# EAGLE design Aquarius (EAGLE 6.4)
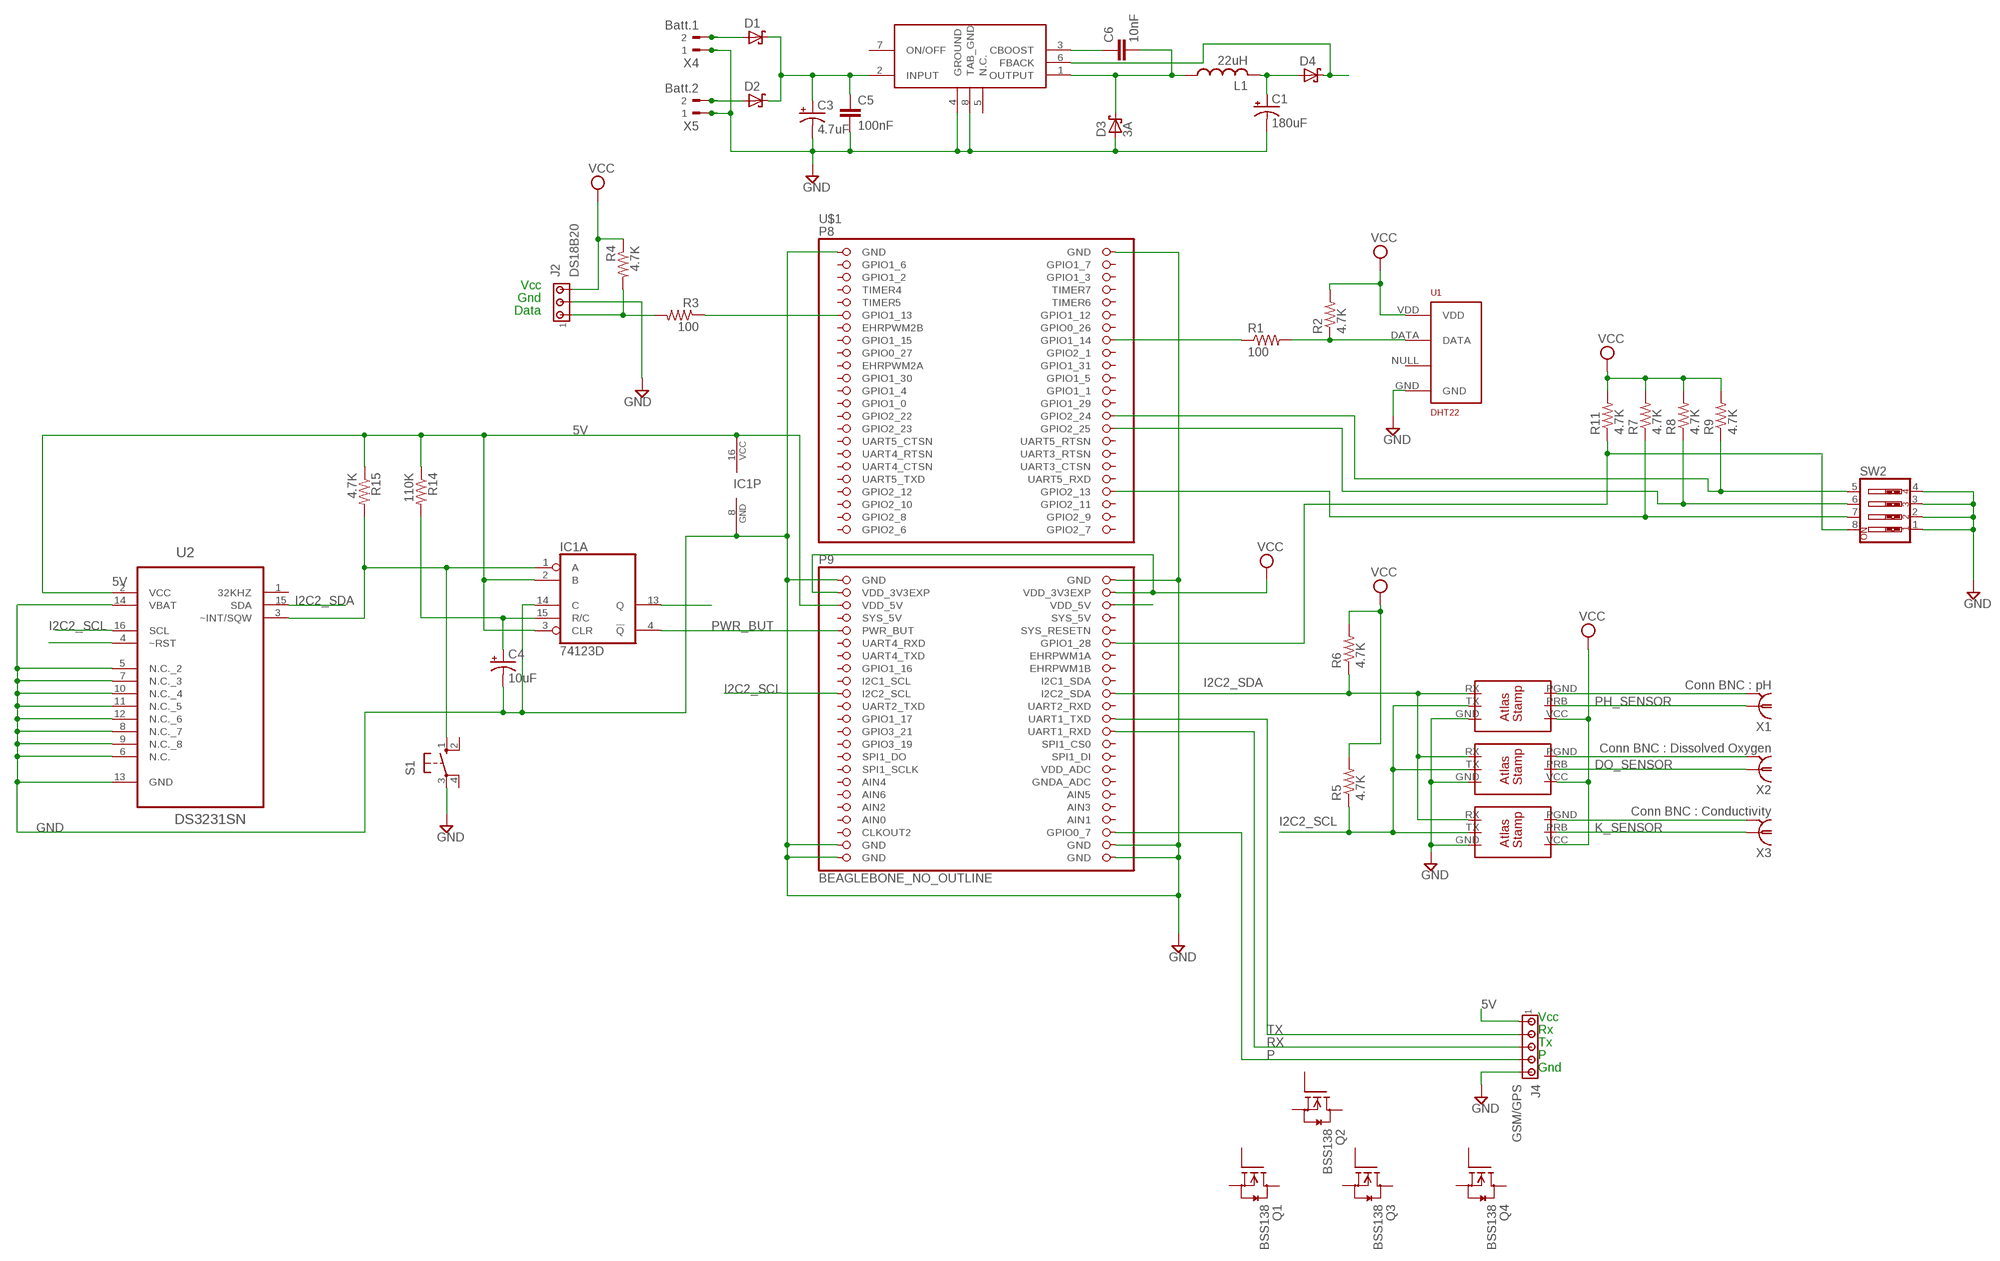
[diagram p0: schematic, sheet 1]

## Parts
C1  180uF  CPOL-USE2,5-6E  [E2,5-6E]
C3  4.7uF  CPOL-USE2,5-6E  [E2,5-6E]
C4  10uF  CPOL-USE2,5-6E  [E2,5-6E]
C5  100nF  C-EUC0805  [C0805@1]
C6  10nF  C-EUC0805  [C0805@1]
D1  SCHOTTKY-DIODEDO201T15  [DO201T15]
D2  SCHOTTKY-DIODEDO201T15  [DO201T15]
D3  3A  SCHOTTKY-DIODEDO201T15  [DO201T15]
D4  SCHOTTKY-DIODEDO201T15  [DO201T15]
IC1  74123D  [SO16]
J2  DS18B20  MTA03-100  [10X03MTA]
J4  GSM/GPS  MTA05-100  [10X05MTA]
L1  22uH  L-USLAL04  [LAL04]
LM2678  LM2678KTW0007B  [TO-PMOD7]
Q1  BSS138  [SOT23]
Q2  BSS138  [SOT23]
Q3  BSS138  [SOT23]
Q4  BSS138  [SOT23]
R1  100  R-US_R0805  [R0805]
R2  4.7K  R-US_R0805  [R0805]
R3  100  R-US_R0805  [R0805]
R4  4.7K  R-US_R0805  [R0805]
R5  4.7K  R-US_R0805  [R0805]
R6  4.7K  R-US_R0805  [R0805]
R7  4.7K  R-US_R0805  [R0805]
R8  4.7K  R-US_R0805  [R0805]
R9  4.7K  R-US_R0805  [R0805]
R11  4.7K  R-US_R0805  [R0805]
R14  110K  R-US_R0805  [R0805]
R15  4.7K  R-US_R0805  [R0805]
S1  10-XX  [B3F-10XX]
SW2  SW_DIP-4  [EDG-04]
U1  DHT22  RHT03_DHT-22_AM2302WIRED  [AM2302]
U2  DS3231SN  [SOIC127P1032X265-16N]
U$1  BEAGLEBONE_NO_OUTLINE  [BEAGLEBONE_SHIELD_NO_OUTLINE]
U$2  ATLAS_STAMP  [ATLAS_STAMP]
U$3  ATLAS_STAMP  [ATLAS_STAMP]
U$4  ATLAS_STAMP  [ATLAS_STAMP]
X1  Conn BNC : pH  1-227161-0  [AMP_227161]
X2  Conn BNC : Dissolved Oxygen  1-227161-0  [AMP_227161]
X3  Conn BNC : Conductivity  1-227161-0  [AMP_227161]
X4  Batt.1  180G-2  [180G-2]
X5  Batt.2  180G-2  [180G-2]

## Nets
5V: D4.C IC1.2(A:B) IC1.3(A:CLR) IC1.16(P:VCC) J4.1 LM2678.6(FBACK) R14.1 R15.1 U2.2(VCC) U$1.51(VDD_5V) U$1.52(VDD_5V)
DO_SENSOR: U$3.PRB X2.1
GND: C1.- C3.- C4.- C5.2 D3.A IC1.8(P:GND) IC1.14(A:C) J2.2 J4.5 LM2678.4(GROUND) LM2678.8(TAB_GND) S1.3(P) SW2.1 SW2.2 SW2.3 SW2.4 U1.GND U2.5(N.C._2) U2.6(N.C.) U2.7(N.C._3) U2.8(N.C._7) U2.9(N.C._8) U2.10(N.C._4) U2.11(N.C._5) U2.12(N.C._6) U2.13(GND) U2.14(VBAT) U$1.1(GND) U$1.2(GND) U$1.47(GND) U$1.48(GND) U$1.89(GND) U$1.90(GND) U$1.91(GND) U$1.92(GND) U$2.GND U$3.GND U$4.GND X4.1 X5.1
I2C2_SCL: R5.1 U2.16(SCL) U$1.65(I2C2_SCL) U$2.TX U$3.TX U$4.TX
I2C2_SDA: R6.1 U2.15(SDA) U$1.66(I2C2_SDA) U$2.RX U$3.RX U$4.RX
INT: IC1.1(A:A) R15.2 S1.1(S) U2.3(~INT/SQW)
K_SENSOR: U$4.PRB X3.1
N$2: D1.A X4.2
N$3: R1.2 R2.1 U1.DATA
N$4: R3.1 U$1.11(GPIO1_13)
N$5: J2.1 R3.2 R4.2
N$6: R1.1 U$1.16(GPIO1_14)
N$7: R7.1 SW2.7 U$1.40(GPIO2_13)
N$8: D2.A X5.2
N$9: C6.1 LM2678.3(CBOOST)
N$10: C3.+ C5.1 D1.C D2.C LM2678.2(INPUT)
N$11: U$2.PGND X1.2
N$12: U2.4(~RST)
N$13: C6.2 D3.C L1.1 LM2678.1(OUTPUT)
N$14: U$4.PGND X3.2
N$15: U$3.PGND X2.2
N$16: C1.+ D4.A L1.2
N$17: C4.+ IC1.15(A:R/C) R14.2
N$18: R11.1 SW2.8 U$1.58(GPIO1_28)
N$19: R8.1 SW2.6 U$1.30(GPIO2_25)
N$20: IC1.13(A:Q)
N$21: R9.1 SW2.5 U$1.28(GPIO2_24)
P: J4.4 U$1.88(GPIO0_7)
PH_SENSOR: U$2.PRB X1.1
PWR_BUT: IC1.4(A:!Q) U$1.55(PWR_BUT)
RX: J4.3 U$1.72(UART1_RXD)
TX: J4.2 U$1.70(UART1_TXD)
VCC: J2.3 R2.2 R4.1 R5.2 R6.2 R7.2 R8.2 R9.2 R11.2 U1.VDD U$1.49(VDD_3V3EXP) U$1.50(VDD_3V3EXP) U$2.VCC U$3.VCC U$4.VCC
Unconnected: IC1.5(B:Q) IC1.6(B:C) IC1.7(B:R/C) IC1.9(B:A) IC1.10(B:B) IC1.11(B:CLR) IC1.12(B:!Q) LM2678.5(N.C.) LM2678.7(ON/OFF) Q1.1(G) Q1.2(S) Q1.3(D) Q2.1(G) Q2.2(S) Q2.3(D) Q3.1(G) Q3.2(S) Q3.3(D) Q4.1(G) Q4.2(S) Q4.3(D) S1.2(S1) S1.4(P1) U1.NULL U2.1(32KHZ) U$1.3(GPIO1_6) U$1.4(GPIO1_7) U$1.5(GPIO1_2) U$1.6(GPIO1_3) U$1.7(TIMER4) U$1.8(TIMER7) U$1.9(TIMER5) U$1.10(TIMER6) U$1.12(GPIO1_12) U$1.13(EHRPWM2B) U$1.14(GPIO0_26) U$1.15(GPIO1_15) U$1.17(GPIO0_27) U$1.18(GPIO2_1) U$1.19(EHRPWM2A) U$1.20(GPIO1_31) U$1.21(GPIO1_30) U$1.22(GPIO1_5) U$1.23(GPIO1_4) U$1.24(GPIO1_1) U$1.25(GPIO1_0) U$1.26(GPIO1_29) U$1.27(GPIO2_22) U$1.29(GPIO2_23) U$1.31(UART5_CTSN) U$1.32(UART5_RTSN) U$1.33(UART4_RTSN) U$1.34(UART3_RTSN) U$1.35(UART4_CTSN) U$1.36(UART3_CTSN) U$1.37(UART5_TXD) U$1.38(UART5_RXD) U$1.39(GPIO2_12) U$1.41(GPIO2_10) U$1.42(GPIO2_11) U$1.43(GPIO2_8) U$1.44(GPIO2_9) U$1.45(GPIO2_6) U$1.46(GPIO2_7) U$1.54(SYS_5V) U$1.56(SYS_RESETN) U$1.57(UART4_RXD) U$1.59(UART4_TXD) U$1.60(EHRPWM1A) U$1.61(GPIO1_16) U$1.62(EHRPWM1B) U$1.63(I2C1_SCL) U$1.64(I2C1_SDA) U$1.67(UART2_TXD) U$1.68(UART2_RXD) U$1.69(GPIO1_17) U$1.71(GPIO3_21) U$1.73(GPIO3_19) U$1.74(SPI1_CS0) U$1.75(SPI1_DO) U$1.76(SPI1_DI) U$1.77(SPI1_SCLK) U$1.78(VDD_ADC) U$1.79(AIN4) U$1.80(GNDA_ADC) U$1.81(AIN6) U$1.82(AIN5) U$1.83(AIN2) U$1.84(AIN3) U$1.86(AIN1) U$1.87(CLKOUT2)

## Notes on the sheet
- Vcc
- Gnd
- Data
- Vcc
- Rx
- Tx
- P
- Gnd

## Power pins joined to a net without a drawn wire
AIN0: U$1.85(AIN0)
SYS_5V: U$1.53(SYS_5V)

## Library data of the parts
C1 C3 C4 = resistor:CPOL-US: POLARIZED CAPACITOR, American symbol
C5 C6 = rcl:C-EU: CAPACITOR, European symbol
D1-D4 = diode:SCHOTTKY-DIODE: Schottky Diode
IC1 = 74xx-us:74*123: Retriggerable monostable MULTIVIBRATOR
J2 = con-amp:MTA03-100: AMP connector
J4 = con-amp:MTA05-100: AMP connector
L1 = rcl:L-US: INDUCTOR, American symbol
LM2678 = Aquarius:LM2678: LM2678 SIMPLE SWITCHER® High Efficiency 5A Step-Down Voltage Regulator
Q1-Q4 = m-pad-2.1:BSS138: Fairchild Semiconductors BSS138 N-Channel Logic Level Enhancement Mode Field Effect Transistor General Description: These N-Channel enhancement mode field effect transistors are produced using Fairchild's proprietary, high cell density, DMOS technology. These products have been designed to minimize on-state resistance while provide rugged, reliable, and fast switching performance.These products are particularly suited for low voltage, low current applications such as small servo motor control, power MOSFET gate drivers, and other switching applications. Features: 0.22 A, 50 V. RDS(ON) = 3.5Ohm @ VGS = 10 V RDS(ON) = 6.0Ohm @ VGS = 4.5 V High density cell design for extremely low RDS(ON) Rugged and Reliable Compact industry standard SOT-23 surface mount package Please send any comments to: messi@users.sourceforge.net
R1-R9 R11 R14 R15 = adafruit:R-US_: RESISTOR, American symbol
S1 = switch-omron:10-XX: OMRON SWITCH; MPN: B3F-1000; OC_FARNELL: 176432; OC_NEWARK: 36M3542
SW2 = special:SW_DIP-4: DIP SWITCH
U1 = RHT03_DHT-22_AM2302:RHT03_DHT-22_AM2302: RHT03 / DHT-22 / AM2302 Packages and symbol for the RHT03 / DHT-22 relative humidity and temperature sensor. Note: The AM2302 is a wired version of the DHT-22 which typically requires less clearance and is thus provided as a separate package.; PROD_ID: SEN-10167
U2 = Maxim_By_element14_Batch_1:DS3231SN: Extremely Accurate I2C-Integrated RTC/TCXO/Crystal; MPN: DS3231SN#; OC_FARNELL: 1593292; OC_NEWARK: 68K3406; PACKAGE: SOIC-16; SUPPLIER: Maxim
U$1 = LEDscape:BEAGLEBONE_NO_OUTLINE: Should match A3 pinout - but not completely tested
U$2-U$4 = LEDscape:ATLAS_STAMP
X1-X3 = con-coax:?227161*: JACK, RIGHT ANGLE, 50 OHM, PCB, BNC Source: amp_227161.pdf; MF: TYCO ELECTRONICS; MPN: 1-227161; OC_FARNELL: unknown; OC_NEWARK: 33B3200
X4 X5 = con-weidmueller-sl35:180G-2: WEIDMUELLER CLAMP CONNECTOR

## Board
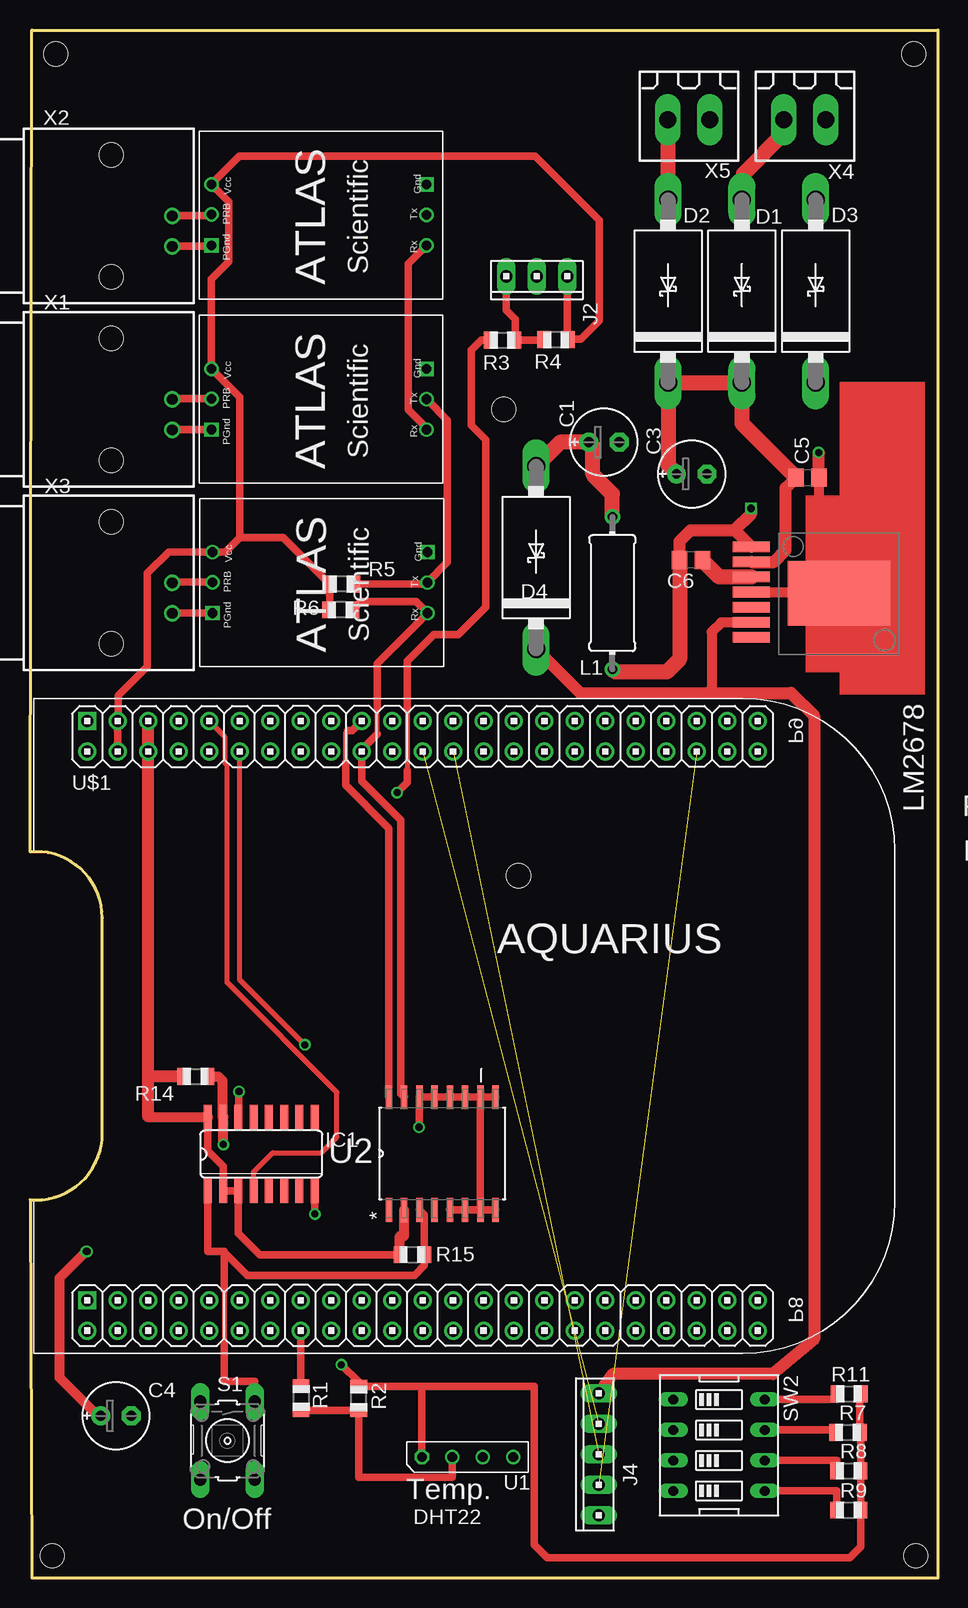
[diagram p1: board, top side]
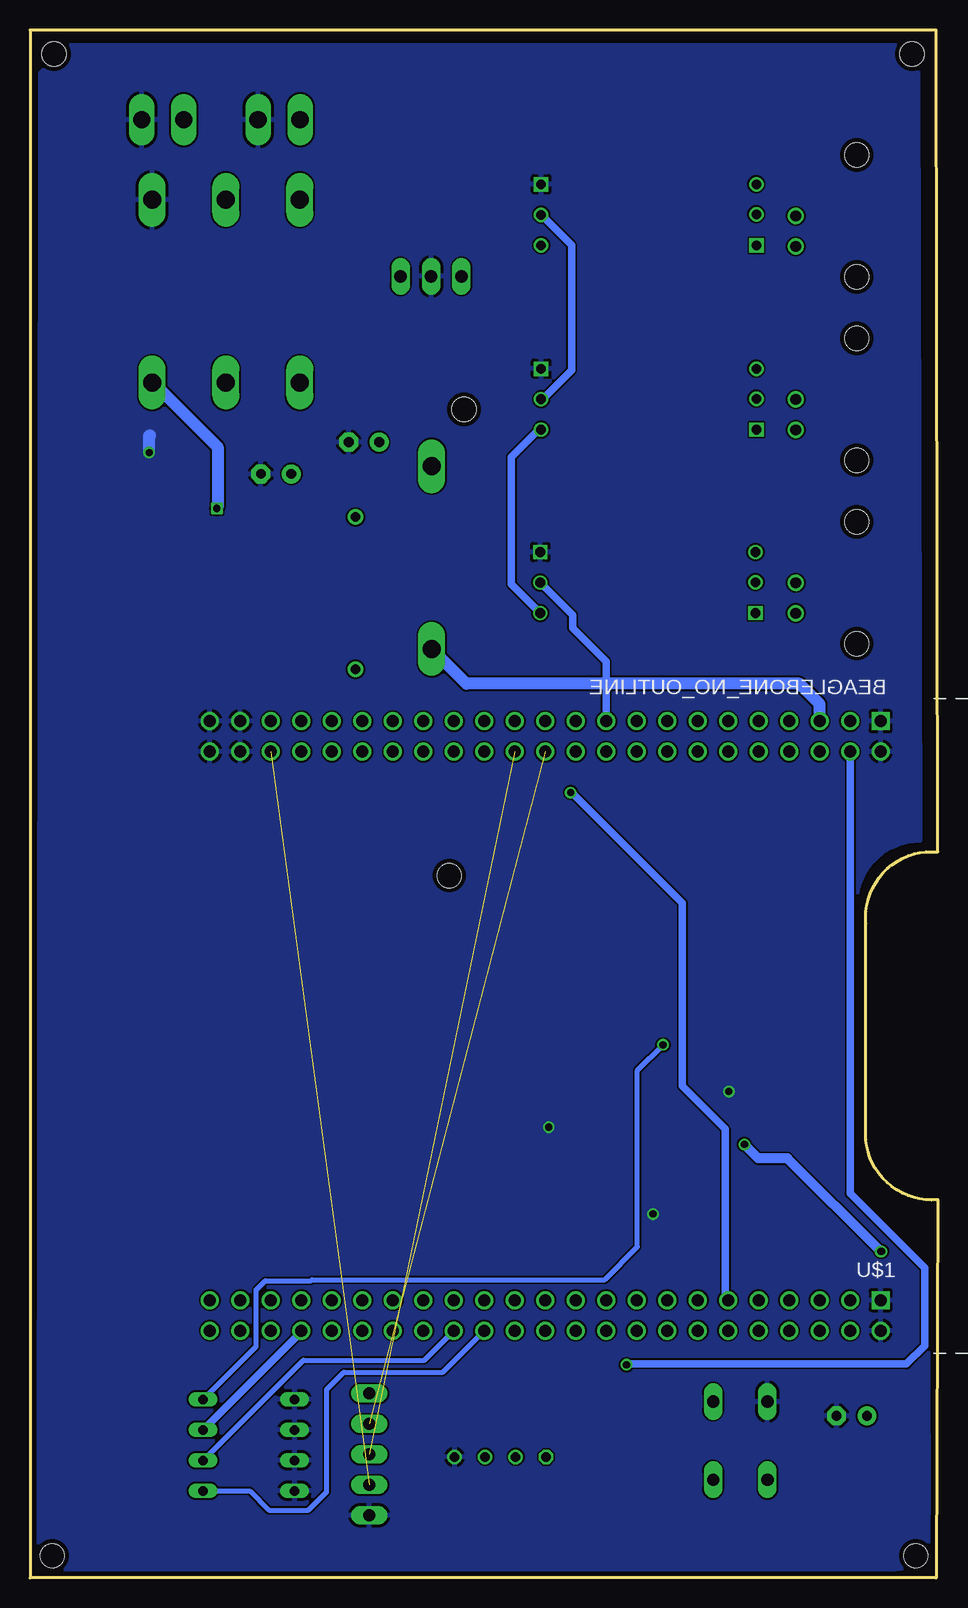
[diagram p2: board, bottom side, seen from below]

Size 75.65 x 129.03 mm. Coordinates in mm from the lower left corner, seen from the top.
Outline: 0.15,129.03 75.65,129.03 75.65,0 0.15,0 0,31.53 arc90 6,36.53 6,54.53 arc90 1,60.53 0,60.53 0.15,129.03
Copper layers (1*16): Top 0.0356mm / dielectric 1.5011mm / Bottom 0.0356mm
Design rules "LaenPCBOrder": minimum track width 6mil, minimum drill 13mil, track to track 6mil, track to pad 6mil, pad to pad 6mil, via to via 6mil, smd to smd 6mil, copper to edge 15mil, drill to drill 6mil, minimum pad ring 7mil, minimum via ring 7mil, stop-mask expansion 3mil, vias tented up to drill 0mil, thermal gap 10mil
Holes 2 mm at 1.85,1.85 73.8,1.85 73.65,127.03 2.15,127.03 40.71,58.54 39.49,97.4

### Footprints (pad centres in the part's own frame; a part is rotated, then mirrored left to right if it is on the bottom)
E2,5-6E = drill 0.813 pad 1.575: + -1.27,0 | drill 0.813 pad 1.575 octagon: - 1.27,0
C0805 = smd 1.3 x 1.5: 1 -0.95,0; 2 0.95,0
DO201T15 = drill 1.499 long: A 7.62,0; C -7.62,0
SO16 = smd 0.66 x 2.032: 1 -4.445,-3.073; 2 -3.175,-3.073; 3 -1.905,-3.073; 4 -0.635,-3.073; 5 0.635,-3.073; 6 1.905,-3.073; 7 3.175,-3.073; 8 4.445,-3.073; 9 4.445,3.073; 10 3.175,3.073; 11 1.905,3.073; 12 0.635,3.073; 13 -0.635,3.073; 14 -1.905,3.073; 15 -3.175,3.073; 16 -4.445,3.073
10X03MTA = drill 1.016 long: 1 2.54,0; 2 0,0; 3 -2.54,0
10X05MTA = drill 1.016 long: 1 5.08,0; 2 2.54,0; 3 0,0; 4 -2.54,0; 5 -5.08,0
LAL04 = drill 0.8 pad 1.3: 1 -6.35,0; 2 6.35,0
TO-PMOD7 = smd 0.89 x 3.06: 1 -3.88,-7.3; 2 -2.62,-7.3; 3 -1.36,-7.3; 4 -0.1,-7.3; 5 1.16,-7.3; 6 2.42,-7.3; 7 3.68,-7.3 | smd 5.35 x 8.54: 8 0.01,0
SOT23 = smd 0.9 x 1.2: 1 -0.95,-1.2; 2 0.95,-1.2; 3 0,1.2
R0805 = smd 1.1 x 1.4: 1 -1,0; 2 1,0
B3F-10XX = drill 1.016 long: 1 -3.251,2.261; 2 3.251,2.261; 3 -3.251,-2.261; 4 3.251,-2.261
EDG-04 = drill 0.813 long: 1 -3.81,-3.81; 2 -1.27,-3.81; 3 1.27,-3.81; 4 3.81,-3.81; 5 3.81,3.81; 6 1.27,3.81; 7 -1.27,3.81; 8 -3.81,3.81
AM2302 = drill 0.8: DATA -1.27,0; GND 3.81,0; NULL 1.27,0 | drill 0.8 octagon: VDD -3.81,0
SOIC127P1032X265-16N = smd 1.981 x 0.533: 1 -4.699,4.445; 2 -4.699,3.175; 3 -4.699,1.905; 4 -4.699,0.635; 5 -4.699,-0.635; 6 -4.699,-1.905; 7 -4.699,-3.175; 8 -4.699,-4.445; 9 4.699,-4.445; 10 4.699,-3.175; 11 4.699,-1.905; 12 4.699,-0.635; 13 4.699,0.635; 14 4.699,1.905; 15 4.699,3.175; 16 4.699,4.445
BEAGLEBONE_SHIELD_NO_OUTLINE = drill 1 square: 1 4.445,19.05; 47 52.705,19.05 | drill 1: 2 1.905,19.05; 3 4.445,21.59; 4 1.905,21.59; 5 4.445,24.13; 6 1.905,24.13; 7 4.445,26.67; 8 1.905,26.67; 9 4.445,29.21; 10 1.905,29.21; 11 4.445,31.75; 12 1.905,31.75; 13 4.445,34.29; 14 1.905,34.29; 15 4.445,36.83; 16 1.905,36.83; 17 4.445,39.37; 18 1.905,39.37; 19 4.445,41.91; 20 1.905,41.91; 21 4.445,44.45; 22 1.905,44.45; 23 4.445,46.99; 24 1.905,46.99; 25 4.445,49.53; 26 1.905,49.53; 27 4.445,52.07; 28 1.905,52.07; 29 4.445,54.61; 30 1.905,54.61; 31 4.445,57.15; 32 1.905,57.15; 33 4.445,59.69; 34 1.905,59.69; 35 4.445,62.23; 36 1.905,62.23; 37 4.445,64.77; 38 1.905,64.77; 39 4.445,67.31; 40 1.905,67.31; 41 4.445,69.85; 42 1.905,69.85; 43 4.445,72.39; 44 1.905,72.39; 45 4.445,74.93; 46 1.905,74.93; 48 50.165,19.05; 49 52.705,21.59; 50 50.165,21.59; 51 52.705,24.13; 52 50.165,24.13; 53 52.705,26.67; 54 50.165,26.67; 55 52.705,29.21; 56 50.165,29.21; 57 52.705,31.75; 58 50.165,31.75; 59 52.705,34.29; 60 50.165,34.29; 61 52.705,36.83; 62 50.165,36.83; 63 52.705,39.37; 64 50.165,39.37; 65 52.705,41.91; 66 50.165,41.91; 67 52.705,44.45; 68 50.165,44.45; 69 52.705,46.99; 70 50.165,46.99; 71 52.705,49.53; 72 50.165,49.53; 73 52.705,52.07; 74 50.165,52.07; 75 52.705,54.61; 76 50.165,54.61; 77 52.705,57.15; 78 50.165,57.15; 79 52.705,59.69; 80 50.165,59.69; 81 52.705,62.23; 82 50.165,62.23; 83 52.705,64.77; 84 50.165,64.77; 85 52.705,67.31; 86 50.165,67.31; 87 52.705,69.85; 88 50.165,69.85; 89 52.705,72.39; 90 50.165,72.39; 91 52.705,74.93; 92 50.165,74.93
ATLAS_STAMP = drill 0.8 square: GND 4.445,18.97; PGND 9.525,1.03 | drill 0.8: PRB 6.95,1.03; RX 9.525,18.97; TX 6.985,18.97; VCC 4.445,1.03
AMP_227161 = drill 0.9 pad 1.27: 1 0,-5.08; 2 -2.54,-5.08 | hole 2: -5.08,0; 5.08,0
180G-2 = drill 1.422 long: 1 -1.75,0; 2 1.75,0

### Placement (x,y rotation side)
C1  47.83,94.68 0 top
C3  55.14,92.03 0 top
C4  7.17,13.51 0 top
C5  100nF  [C0805]  64.8,91.72 0 top
C6  10nF  [C0805]  55.08,84.83 180 top
D1  59.33,107.26 90 top
D2  53.17,107.26 90 top
D3  65.47,107.26 90 top
D4  42.18,85.05 90 top
DRILEGEND  [DRILEGEND]  0.13,-6.35 0 top  (outside the outline)
IC1  19.27,35.33 0 top
J2  42.23,108.5 180 top
J4  47.39,10.3 90 top
L1  48.53,82.09 90 top
LM2678  67.41,82.08 270 top
Q1  -37.38,-65.6 0 top  (outside the outline)
Q2  -37.38,-43.65 0 top  (outside the outline)
Q3  -37.38,-50.97 0 top  (outside the outline)
Q4  -37.38,-58.28 0 top  (outside the outline)
R1  22.59,15 270 top
R2  27.39,14.97 90 top
R3  39.38,103.17 0 top
R4  43.83,103.21 180 top
R5  25.96,82.85 180 top
R6  25.89,80.71 180 top
R7  68.16,12.13 0 top
R8  68.24,8.93 0 top
R9  68.24,5.65 0 top
R11  68.26,15.34 0 top
R14  13.81,41.8 0 top
R15  31.87,26.94 0 top
S1  16.46,11.44 270 top
SW2  57.42,11.06 270 top
U1  36.46,10.08 0 top
U2  34.36,35.38 90 top
U$1  -14.28,18.71 90 bottom
U$2  14.09,105.24 270 top
U$3  14.09,120.61 270 top
U$4  14.16,89.95 270 top
X1  6.76,98.24 90 top
X2  6.76,113.53 90 top
X3  6.76,82.95 90 top
X4  64.58,121.55 180 top
X5  54.9,121.55 180 top

### Tracks (layer width: path | path; a pad name or v marks a point on that pad's centre or on a via)
5V  (via drill 0.6)
  Top 0.61: IC1.16 14.83,35.59 16.12,34.3 16.12,32.28 IC1.2 IC1.3 17.34,32.23 17.34,28.74 19.13,26.94 R15.1
  Top 0.813: IC1.16 9.85,38.41 9.85,38.49 | R15.1 30.82,26.94 30.82,28.51 31.18,28.51 U2.2 | LM2678.6 57.59,79.66 56.81,78.88 56.81,74.08 56.5,73.77
  Top 1.016: 9.85,38.49 9.85,42 | 9.85,42 U$1.52 v9.85,71.23 U$1.51 | R14.1 10.05,41.8 9.85,42 | D4.C 45.83,73.77 56.5,73.77 63.44,73.77 65.34,71.87 65.34,19.9 61.91,17 48.58,17 47.41,15.38 J4.1
  Bottom 1.016: v9.85,71.23 9.85,72.84 11.54,74.53 39.28,74.53 D4.C
DO_SENSOR
  Top 0.61: X2.1 14.99,113.53 U$3.PRB
GND  (via drill 0.6)
  Top 0.61: U2.5 U2.6 U2.7 | 17.34,38.41 IC1.14 17.41,38.41 v17.41,40.55 | U2.10 U2.11 U2.12 U2.13 U2.14 32.42,40.08 v32.42,37.58 | U2.10 U2.9 | U2.10 U2.7 | U2.7 U2.8 | IC1.8 23.74,32.26 v23.74,30.34 23.74,30.26
  Top 0.813: LM2678.4 67.3,82.18 LM2678.8 65.75,83.73 C5.2
  Top 1.016: C5.2 65.75,93.79 v65.72,93.81
  Bottom 1.016: v65.72,93.81 65.72,95.18 65.65,95.26
  pour Bottom: 1.49,61.5 1.64,125.59 3.31,127.72 72.66,127.72 74.79,125.44 74.94,0.77 3.47,0.77 0.72,1.08 0.88,30.26 1.33,30.26 arc90 6.82,35.75 6.82,56.17 arc90
I2C2_SCL
  Top 0.406: 26.33,67.98 26.33,70.5 26.48,70.65
  Top 0.61: U2.16 29.91,62.49 26.33,66.08 26.33,67.98 | 26.48,70.65 26.87,70.65 U$1.65 | R5.1 33.02,82.85 U$4.TX 33.13,83.02 34.79,84.67 34.79,96.53 U$2.TX
  Bottom 0.61: U$1.65 27.63,76.37 30.44,79.18 30.44,80.28 U$4.TX | U$2.TX 32.93,98.26 30.52,100.67 30.52,111.09 U$3.TX
I2C2_SDA
  Top 0.406: 28.92,70.34 28.92,72.55
  Top 0.61: U2.15 30.9,40.36 30.9,63.18 27.63,66.45 U$1.66 27.63,69.06 28.92,70.34 | 28.92,72.55 28.92,76.21 U$4.RX 33.13,80.45 32.19,81.39 27.57,81.39 R6.1 | U$2.RX 33.06,95.85 31.51,97.39 31.51,109.54 U$3.RX
  Bottom 0.61: U$2.RX 33.26,95.72 35.55,93.43 35.55,82.84 U$4.RX
INT
  Top 0.406: 16.19,24.01 16.19,19.52
  Top 0.61: IC1.1 14.82,32.26 14.82,27.21 16.19,27.21 16.19,27.14 | 16.19,27.14 16.19,24.01 | 16.19,19.52 16.19,16.39 18.72,16.39 S1.1 | 16.19,27.14 18.1,25.23 32.04,25.23 32.87,26.06 R15.2 32.87,30.26 U2.3
K_SENSOR
  Top 0.61: U$4.PRB 11.89,83 X3.1
N$1  (via drill 0.6)
  other vias: 4.76,27.21
N$2
  Top 1.27: X4.2 62.83,120.41 59.47,117.05 59.47,115.03 D1.A
N$3
  Top 0.61: R1.2 22.59,13.97 R2.1 27.39,8.39 35.19,8.39 U1.DATA
N$4  (via drill 0.6)
  Top 0.406: 31.43,72.32 31.43,67.3
  Top 0.61: R3.1 37.59,103.17 36.77,102.35 36.77,96.1 37.99,94.88 37.99,80.94 35.7,78.65 33.64,78.65 31.43,76.44 31.43,72.32 | 31.43,67.3 31.43,66.3 v30.59,65.47
  Bottom 0.61: v30.59,65.47 30.52,65.47 21.3,56.25 21.3,41.01 17.72,37.43 17.72,23.4 U$1.11
N$5
  Top 0.61: J2.1 39.69,105.67 40.42,104.94 40.42,103.21 R3.2 42.79,103.17 R4.2
N$6
  Top 0.61: R1.1 22.55,16 U$1.16
N$7
  Top 0.61: SW2.7 67.16,12.33 R7.1
  Bottom 0.61: SW2.7 53.03,20.52 U$1.40
N$8
  Top 1.27: X5.2 53.15,114.9 D2.A
N$9
  Top 1.27: LM2678.3 57.42,83.44 C6.1
N$10
  Top 1.016: LM2678.2 62.02,84.7 62.98,85.66 62.98,90.86 C5.1
  Top 1.27: C3.+ 53.17,92.73 D2.C D1.C 59.33,96.24 C5.1
N$11
  Top 0.61: X1.2 15.1,95.7 U$2.PGND
N$13  (via drill 0.6)
  Top 1.016: C6.2 54.13,86.41 55.05,87.34 58.73,87.34 | 58.73,87.34 LM2678.1 | v60.08,89.16 60.08,88.69 58.73,87.34
  Top 1.27: C6.2 54.13,76.58 53.07,75.53 48.74,75.53 L1.1
  Bottom 1.016: D3.C 65.38,99.64 60.01,94.27 60.01,89.24 v60.08,89.16
N$14
  Top 0.61: X3.2 15.18,80.41 U$4.PGND
N$15
  Top 0.61: X2.2 15.02,110.99 U$3.PGND
N$16
  Top 1.27: D4.A 44.18,94.68 C1.+ 46.9,94.33 46.9,91.98 48.53,90.36 L1.2
N$17  (via drill 0.6)
  Top 0.61: IC1.15 16.19,38.41
  Top 0.813: R14.2 15.71,41.8 16.04,41.46 16.04,38.47 IC1.15 16.12,38.39 v16.12,36.13 | C4.+ 5.66,13.51 2.48,16.7 2.48,25 v4.69,27.21
  Bottom 0.813: v4.69,27.21 4.76,27.21 12.53,34.99 14.97,34.99 v16.12,36.13
N$18  (via drill 0.6)
  Top 0.406: v22.9,44.44 17.47,49.86 U$1.58
  Top 0.61: SW2.8 67.26,14.87 R11.1
  Bottom 0.406: SW2.8 56.81,19.29 56.81,24.01 56.04,24.78 52.23,24.78 52.16,24.85 27.77,24.85 25.03,27.6 25.03,42.3 v22.9,44.44
N$19
  Top 0.61: SW2.6 67.24,9.79 R8.1
  Bottom 0.406: SW2.6 52.87,18.15 42.8,18.15 U$1.30
N$21
  Top 0.61: R9.1 67.24,7.25 SW2.5
  Bottom 0.406: SW2.5 57.34,7.25 55.74,5.65 52.46,5.65 50.94,7.17 50.94,15.71 49.49,17.16 41.25,17.16 U$1.28
P  (1 unrouted)
PH_SENSOR
  Top 0.61: U$2.PRB 11.89,98.29 X1.1
PWR_BUT
  Top 0.406: IC1.4 18.64,33.85 20.23,35.44 24.27,35.44 25.56,36.74 25.56,40.47 16.42,49.62 16.42,67.75 16.27,67.91 16.27,70.08 U$1.55
RX  (1 unrouted)
TX  (1 unrouted)
VCC  (via drill 0.6)
  Top 0.61: R11.2 69.16,15.34 R7.2 69.24,12.13 R8.2 R9.2 69.23,5.64 69.23,2.6 68.31,1.69 43.09,1.69 42.02,2.75 42.02,15.97 32.65,15.97 | U1.VDD 32.65,15.97 | 32.65,15.97 R2.2 27.39,16.33 v25.95,17.77 | J2.3 44.77,103.26 | 44.77,103.26 R4.1 | 17.49,86.73 16.27,85.51 U$4.VCC 11.55,85.51 9.79,83.75 9.79,75.98 7.35,73.54 7.35,71.45 U$1.49 U$1.50 | 17.49,86.73 17.49,98.43 U$2.VCC 15.12,108.28 16.57,109.74 16.57,114.71 U$3.VCC 17.45,118.5 42.1,118.5 47.43,113.17 47.43,104.79 45.91,103.26 44.77,103.26 | 17.49,86.73 21.09,86.73 R5.2 24.96,80.78 R6.2
  Bottom 0.61: U$1.50 7.31,32.05 1.1,25.84 1.1,19.37 2.63,17.84 25.87,17.84 v25.95,17.77
(copper drawn outside any net)
  shapes: Top area x2

### Text on the board
tPlace: AQUARIUS
tNames: LM2678 | Field | Lab | Temp. | On/Off
DrillLegend: LAYER-STACK
DrillLegend_01-16: 01-16
DrillLegend_01-20: 01-20